# EAGLE schematic CAN (EAGLE 9.6.2)
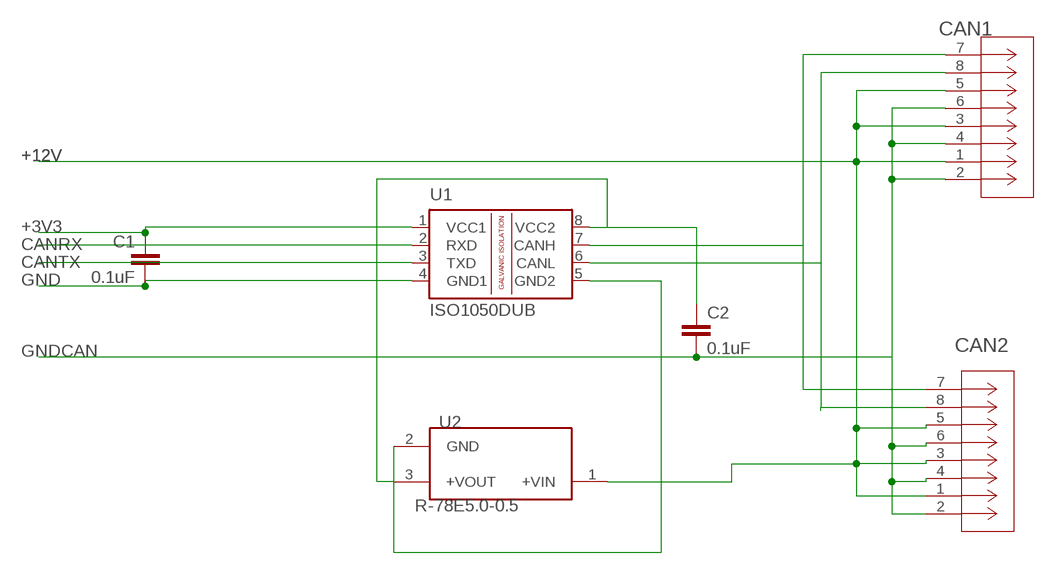
[diagram p0: schematic, sheet 1]

## Parts
C1  0.1uF  C5/3.5  [C5B3.5]
C2  0.1uF  C2.5/4  [C2.5-4]
CAN1  A-2004-2-4-LPS-N-R  [CONN_4-LPS-N-R_ASM]
CAN2  A-2004-2-4-LPS-N-R  [CONN_4-LPS-N-R_ASM]
U1  ISO1050DUB  [DUB-R-PDSO-G8]
U2  R-78E5.0-0.5  [CONV_R-78E5.0-0.5]

## Nets
+3V3: C1.2 U1.1(VCC1)
+12V: CAN1.1 CAN1.3 CAN1.5 CAN2.1 CAN2.3 CAN2.5 U2.1(+VIN)
CANRX: U1.2(RXD)
CANTX: U1.3(TXD)
GND: C1.1 U1.4(GND1)
GNDCAN: C2.2 CAN1.2 CAN1.4 CAN1.6 CAN2.2 CAN2.4 CAN2.6
N$3: CAN1.7 CAN2.7 U1.7(CANH)
N$4: CAN1.8 CAN2.8 U1.6(CANL)
N$5: U2.3(+VOUT)
N$6: U1.5(GND2) U2.2(GND)
N$11: C2.1 U1.8(VCC2)

## Library data of the parts
C1 C2 = capacitor-wima:C: CAPACITOR naming: grid - package width
CAN1 CAN2 = A-2004-2-4-LPS-N-R:A-2004-2-4-LPS-N-R; COPYRIGHT: Copyright (C) 2021 Ultra Librarian. All rights reserved.; DIGI-KEY_PART_NUMBER_1: AE10387-ND; MANUFACTURER_PART_NUMBER: A-2004-2-4-LPS-N-R; MFR_NAME: Assmann
U1 = texas:ISO1050: ISOLATED CAN TRANSCEIVER Source: http://focus.ti.com/lit/ds/symlink/iso1050.pdf; MPN: ISO1050DUBR; OC_FARNELL: 1755712; OC_NEWARK: 14R9899
U2 = R-78E5.0-0.5:R-78E5.0-0.5: 0.5 Amp SIP3 Single Output; DESCRIPTION: Switching regulator module - DC/DC converter . Single Output. 7.0V to 28.0V input voltage range and 5 V output voltage range; DIGI-KEY_PART_NUMBER: 945-1648-5-ND; MF: Recom Power; MP: R-78E5.0-0.5; PACKAGE: SIP-3 Recom Power; PURCHASE-URL: https://pricing.snapeda.com/search/part/R-78E5.0-0.5/?ref=eda